# Altium schematic sheet MINIRACER-FMU.SchDoc
size A4
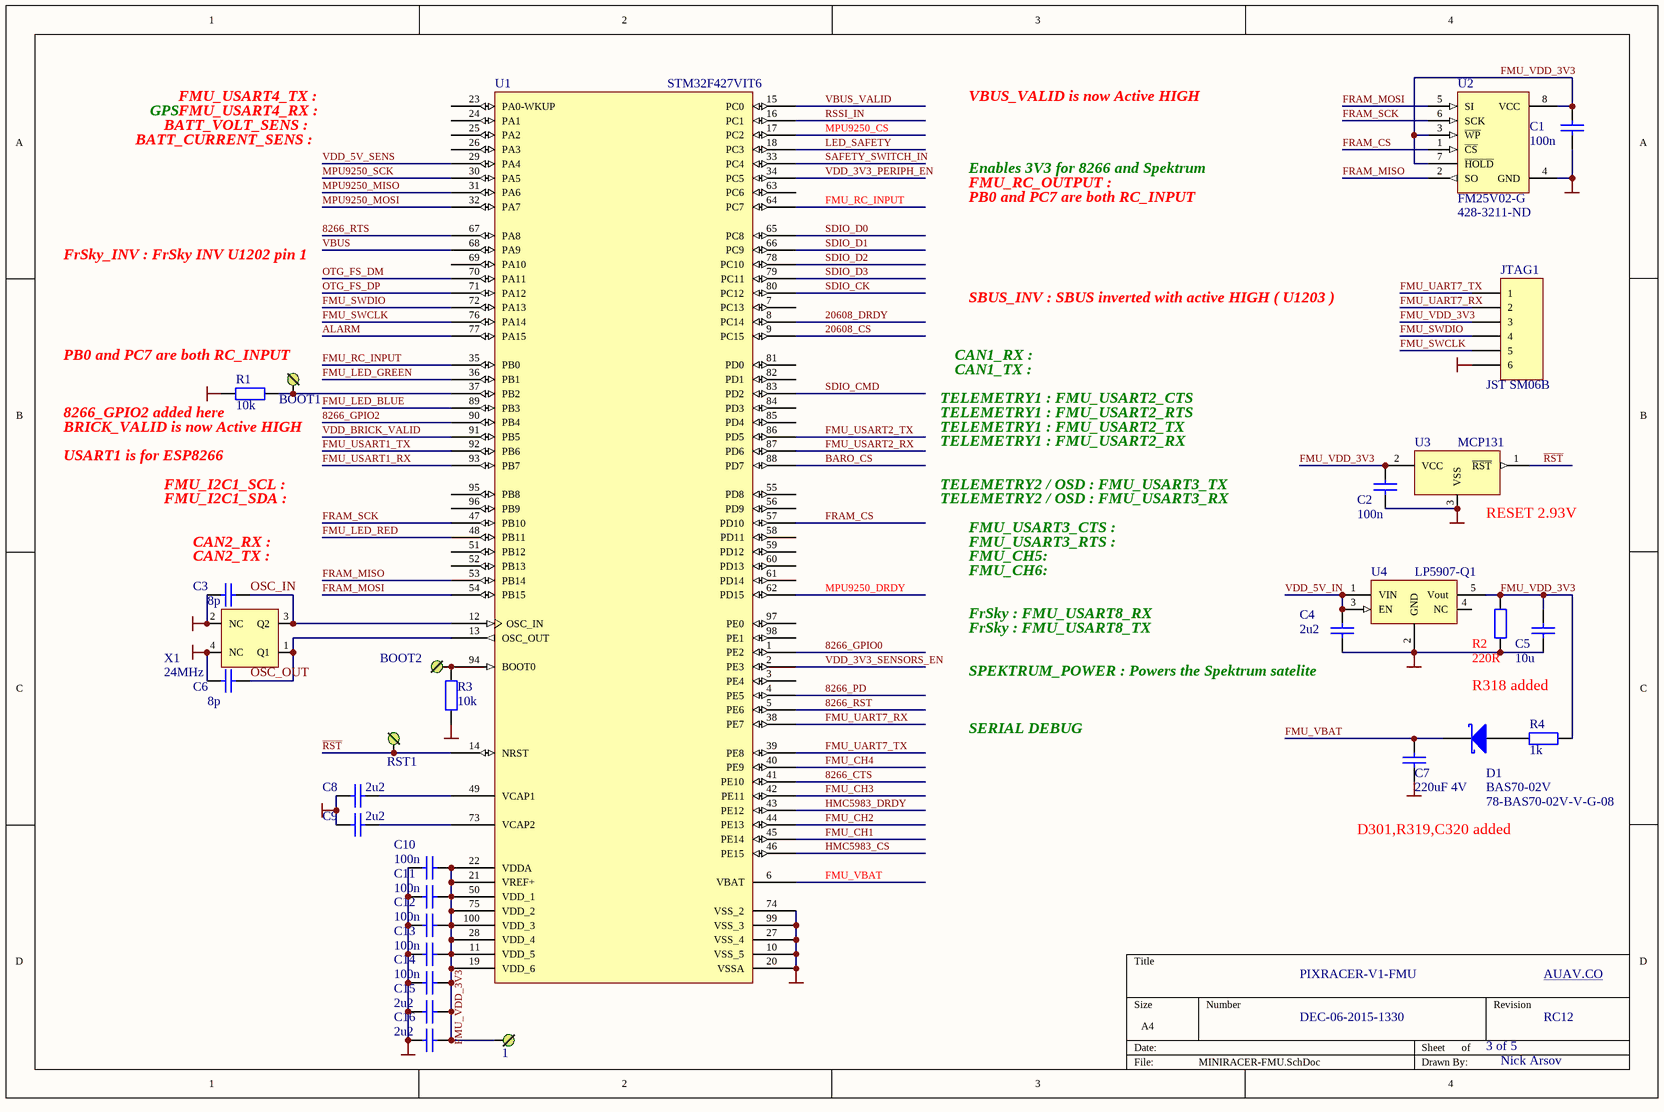
[diagram p0: MINIRACER-FMU.SchDoc]

## Parts
1  3V3  [PAD1]  (value not drawn)
BOOT1  BOOT1  [PAD1]  (value not drawn)
BOOT2  BOOT  [PAD1]  (value not drawn)
C1  100n  [0402A]
C2  100n  [0402A]
C3  8p  [0603A]
C4  2u2  [0603A]
C5  10u  [0603A]
C6  8p  [0603A]
C7  220uF 4V  [1206A]
C8  2u2  [0402A]
C9  2u2  [0402A]
C10  100n  [0402A]
C11  100n  [0402A]
C12  100n  [0402A]
C13  100n  [0402A]
C14  100n  [0402A]
C15  2u2  [0402A]
C16  2u2  [0402A]
D1  BAS70-02V  Mouser: 78-BAS70-02V-V-G-08  [SOD-523]
JTAG1  JST SM06B  [HDR1X6]
R1  10k  [0402A]
R2  220R  [0603A]
R3  10k  [0402A]
R4  1k  [0603A]
RST1  BOOT  [PAD1]  (value not drawn)
U1  STM32F427VIT6  [LQFP100_L]
U2  FM25V02-G  Supplier Part Number: 428-3211-ND  [SO-8_N]
U3  MCP131  [SOT-323]
U4  LP5907-Q1  [SOT23-5]
X1  24MHz  [Crystal_2.5x2]

## Nets
GND: C1.1 C2.1 C3.1 C4.1 C5.1 C6.1 C7.1 C8.2 C9.2 C10.1 C11.1 C12.1 C13.1 C14.1 C15.1 C16.1 JTAG1.6 R1.1 R2.1 R3.2 U1.10(VSS_5) U1.20(VSSA) U1.27(VSS_4) U1.74(VSS_2) U1.99(VSS_3) U2.4(GND) U3.3(VSS) U4.2(GND) X1.2(NC) X1.4(NC)
8266_CTS: U1.41(PE10)
8266_GPIO0: U1.1(PE2)
8266_GPIO2: U1.90(PB4)
8266_PD: U1.4(PE5)
8266_RST: U1.5(PE6)
8266_RTS: U1.67(PA8)
20608_CS: U1.9(PC15)
20608_DRDY: U1.8(PC14)
~{RST}: RST1.1 U1.14(NRST) U3.1(~{RST})
ALARM: U1.77(PA15)
BARO_CS: U1.88(PD7)
FMU_CH1: U1.45(PE14)
FMU_CH2: U1.44(PE13)
FMU_CH3: U1.42(PE11)
FMU_CH4: U1.40(PE9)
FMU_LED_BLUE: U1.89(PB3)
FMU_LED_GREEN: U1.36(PB1)
FMU_LED_RED: U1.48(PB11)
FMU_RC_INPUT: U1.35(PB0) U1.64(PC7)
FMU_SWCLK: JTAG1.5 U1.76(PA14)
FMU_SWDIO: JTAG1.4 U1.72(PA13)
FMU_UART7_RX: JTAG1.2 U1.38(PE7)
FMU_UART7_TX: JTAG1.1 U1.39(PE8)
FMU_USART1_RX: U1.93(PB7)
FMU_USART1_TX: U1.92(PB6)
FMU_USART2_RX: U1.87(PD6)
FMU_USART2_TX: U1.86(PD5)
FMU_VBAT: C7.2 D1.2(K) U1.6(VBAT)
FMU_VDD_3V3: 1.1 C1.2 C2.2 C5.2 C10.2 C11.2 C12.2 C13.2 C14.2 C15.2 C16.2 JTAG1.3 R2.2 R4.1 U1.11(VDD_5) U1.19(VDD_6) U1.21(VREF+) U1.22(VDDA) U1.28(VDD_4) U1.50(VDD_1) U1.75(VDD_2) U1.100(VDD_3) U2.3(~{WP}) U2.7(~{HOLD}) U2.8(VCC) U3.2(VCC) U4.5(Vout)
FRAM_CS: U1.57(PD10) U2.1(~{CS})
FRAM_MISO: U1.53(PB14) U2.2(SO)
FRAM_MOSI: U1.54(PB15) U2.5(SI)
FRAM_SCK: U1.47(PB10) U2.6(SCK)
HMC5983_CS: U1.46(PE15)
HMC5983_DRDY: U1.43(PE12)
LED_SAFETY: U1.18(PC3)
MPU9250_CS: U1.17(PC2)
MPU9250_DRDY: U1.62(PD15)
MPU9250_MISO: U1.31(PA6)
MPU9250_MOSI: U1.32(PA7)
MPU9250_SCK: U1.30(PA5)
OSC_IN: C3.2 U1.12(OSC_IN) X1.3(Q2)
OSC_OUT: C6.2 U1.13(OSC_OUT) X1.1(Q1)
OTG_FS_DM: U1.70(PA11)
OTG_FS_DP: U1.71(PA12)
RSSI_IN: U1.16(PC1)
SAFETY_SWITCH_IN: U1.33(PC4)
SDIO_CK: U1.80(PC12)
SDIO_CMD: U1.83(PD2)
SDIO_D0: U1.65(PC8)
SDIO_D1: U1.66(PC9)
SDIO_D2: U1.78(PC10)
SDIO_D3: U1.79(PC11)
VBUS: U1.68(PA9)
VBUS_VALID: U1.15(PC0)
VDD_3V3_PERIPH_EN: U1.34(PC5)
VDD_3V3_SENSORS_EN: U1.2(PE3)
VDD_5V_IN: C4.2 U4.1(VIN) U4.3(EN)
VDD_5V_SENS: U1.29(PA4)
VDD_BRICK_VALID: U1.91(PB5)
NetBOOT1_1: BOOT1.1 R1.2 U1.37(PB2)
NetBOOT2_1: BOOT2.1 R3.1 U1.94(BOOT0)
NetC8_1: C8.1 U1.49(VCAP1)
NetC9_1: C9.1 U1.73(VCAP2)
NetD1_1: D1.1(A) R4.2

Not connected (* = marked no-connect by the designer): U1 3(PE4) 7(PC13) 23(PA0-WKUP) 24(PA1) 25(PA2) 26(PA3) 51(PB12) 52(PB13) 55(PD8) 56(PD9) 58(PD11) 59(PD12) 60(PD13) 61(PD14) 63(PC6) 69(PA10) 81(PD0) 82(PD1) 84(PD3) 85(PD4) 95(PB8) 96(PB9) 97(PE0) 98(PE1); U4 4(NC)

## Notes on the sheet
- GPS
- FMU_USART4_TX :
- FMU_USART4_RX :
- VBUS_VALID is now Active HIGH
- BATT_CURRENT_SENS :
- BATT_VOLT_SENS :
- Enables 3V3 for 8266 and Spektrum
- FMU_RC_OUTPUT :
- FrSky_INV : FrSky INV U1202 pin 1
- PB0 and PC7 are both RC_INPUT
- SBUS_INV : SBUS inverted with active HIGH ( U1203 )
- (near BOOT1) PB0 and PC7 are both RC_INPUT
- TELEMETRY1 : FMU_USART2_CTS
- CAN1_RX :
- CAN1_TX :
- (near R1) USART1 is for ESP8266
- BRICK_VALID is now Active HIGH
- (near R1) 8266_GPIO2 added here
- TELEMETRY1 : FMU_USART2_TX
- TELEMETRY1 : FMU_USART2_RX
- TELEMETRY1 : FMU_USART2_RTS
- FMU_I2C1_SCL :
- FMU_I2C1_SDA :
- (near C3) CAN2_RX :
- TELEMETRY2 / OSD : FMU_USART3_TX
- TELEMETRY2 / OSD : FMU_USART3_RX
- FMU_USART3_CTS :
- FMU_USART3_RTS :
- (near U3) RESET 2.93V
- (near C3) CAN2_TX :
- FrSky : FMU_USART8_RX
- FMU_CH6:
- FMU_CH5:
- (near C4) SPEKTRUM_POWER : Powers the Spektrum satelite
- FrSky : FMU_USART8_TX
- R318 added
- SERIAL DEBUG
- D301,R319,C320 added
- PIXRACER-V1-FMU
- AUAV.CO
- DEC-06-2015-1330
- 3 of 5
- RC12
- Nick Arsov

## Library data of the parts
1 BOOT1 BOOT2 RST1 = PLUG
C1-C16 = Cap: Capacitor; Value: 100pF; Published: 8-Jun-2000; LatestRevisionDate: 17-Jul-2002; LatestRevisionNote: Re-released for DXP Platform.; PackageReference: RAD-0.3; Publisher: Altium Limited
  C7: PackageDescription: Radial Cap, Thru-Hole; 2 Leads; 0.3 in Pin Spacing
D1 = D Schottky: Schottky Diode; Published: 8-Jun-2000; LatestRevisionDate: 17-Jul-2002; LatestRevisionNote: Re-released for DXP Platform.; PackageReference: SMB; Publisher: Altium Limited; PackageDescription: DO-214-AA/SMB; 2 C-Bend Leads; Body 5.3 x 3.6 mm, inc. leads (LxW); Code_JEDEC: DO-214-AA
JTAG1 = Header 6: Header, 6-Pin; LatestRevisionDate: 17-Jul-2002; LatestRevisionNote: Re-released for DXP Platform.; Publisher: Altium Limited
R1-R3 = Res2: Resistor; Value: 1K; Published: 8-Jun-2000; LatestRevisionDate: 17-Jul-2002; LatestRevisionNote: Re-released for DXP Platform.; PackageReference: AXIAL-0.4; Publisher: Altium Limited; PackageDescription: Axial Device, Thru-Hole; 2 Leads; 0.4 in Pin Spacing
R4 = Res2: Resistor; Published: 8-Jun-2000; LatestRevisionDate: 17-Jul-2002; LatestRevisionNote: Re-released for DXP Platform.; PackageReference: AXIAL-0.4; Publisher: Altium Limited; PackageDescription: Axial Device, Thru-Hole; 2 Leads; 0.4 in Pin Spacing; Value: 1K
U1 = STM32F103VBT6: STM32 ARM-based 32-bit MCU with 64 Kbytes Flash, 100-pin LQFP, Industrial Temperature; Published: 30-May-2008; DatasheetVersion: rev6, Mar-2008; PackageVersion: Mar-2008; PackageReference: LQFP100; Publisher: Altium Limited; PackageDescription: 100-Pin Low-Profile Quad Flat Pack, 14 x 14 mm Body, 0.5 mm Pitch (LQFP100); ComponentLink1Description: Manufacturer Link; ComponentLink1URL: www.st.com/stm32; ComponentLink2Description: Datasheet; ComponentLink2URL: http://www.st.com/stonline/products/literature/ds/13587.pdf
U2 = AT45DB161D-MU
U3 = MCP102
X1 = Crystal_4pin: Supplier Part Number: 644-1052-1-ND